# EAGLE schematic ProPinEZMachBAutoRouteV2c (EAGLE 7.1.0)
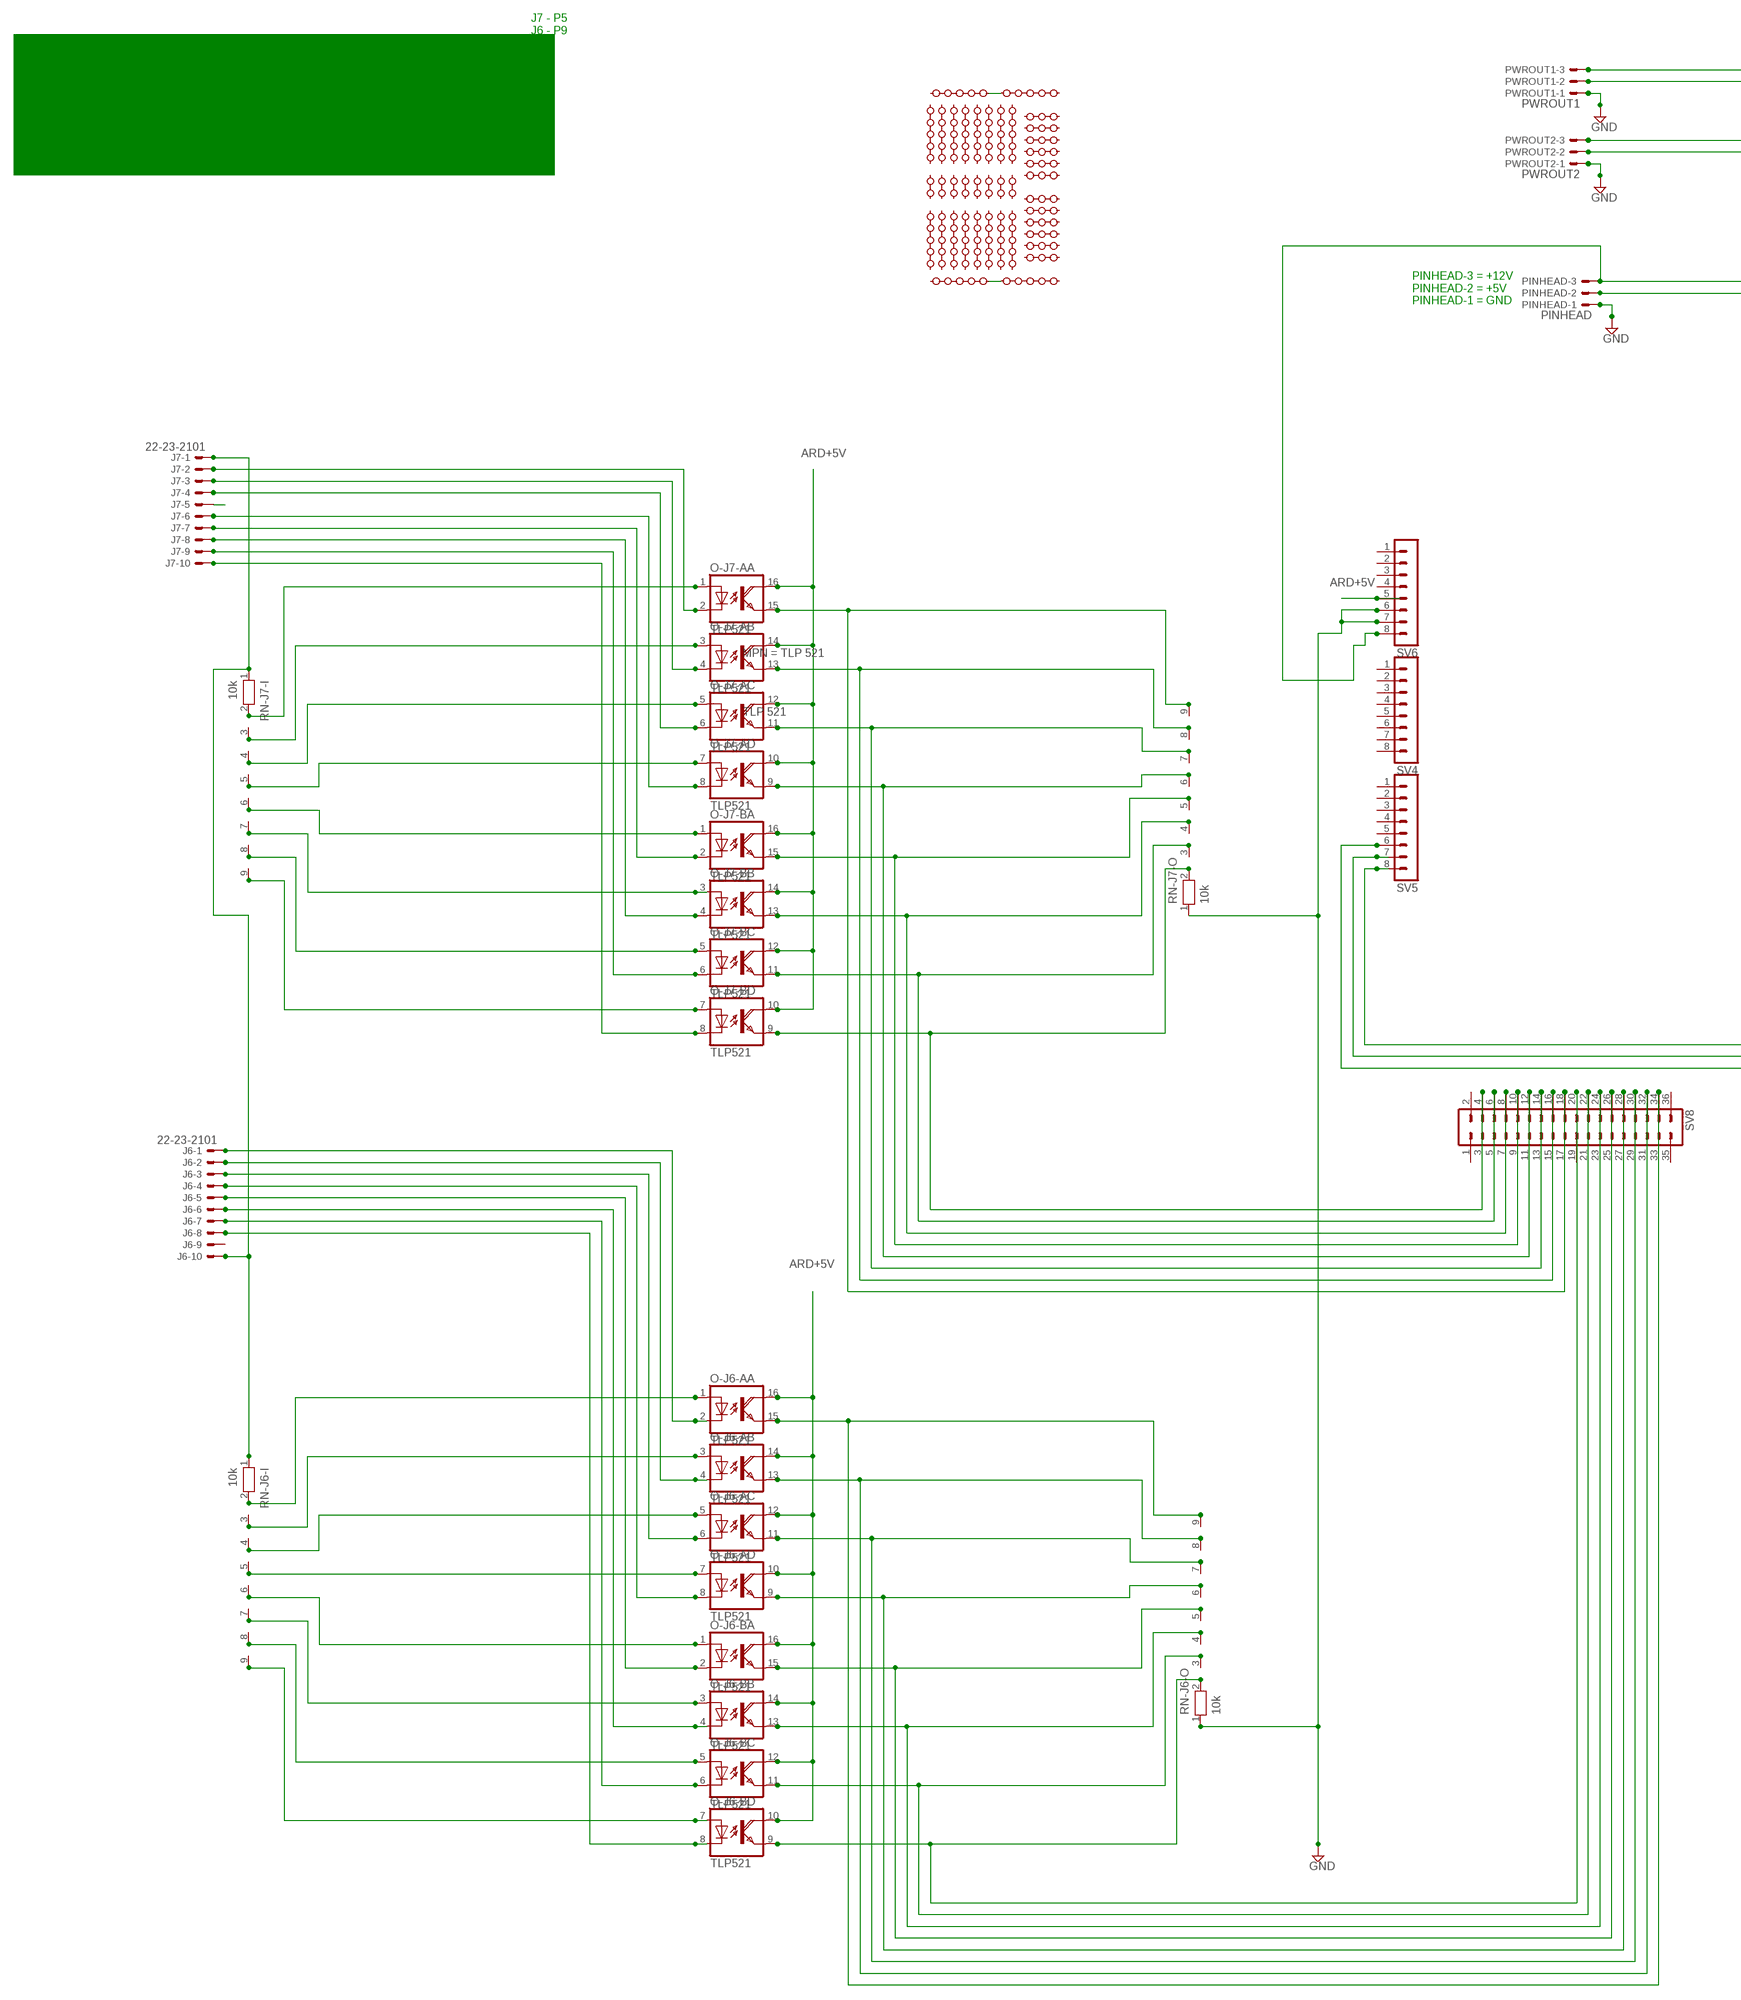
[diagram p0: schematic, sheet 1, part 1 of 2]
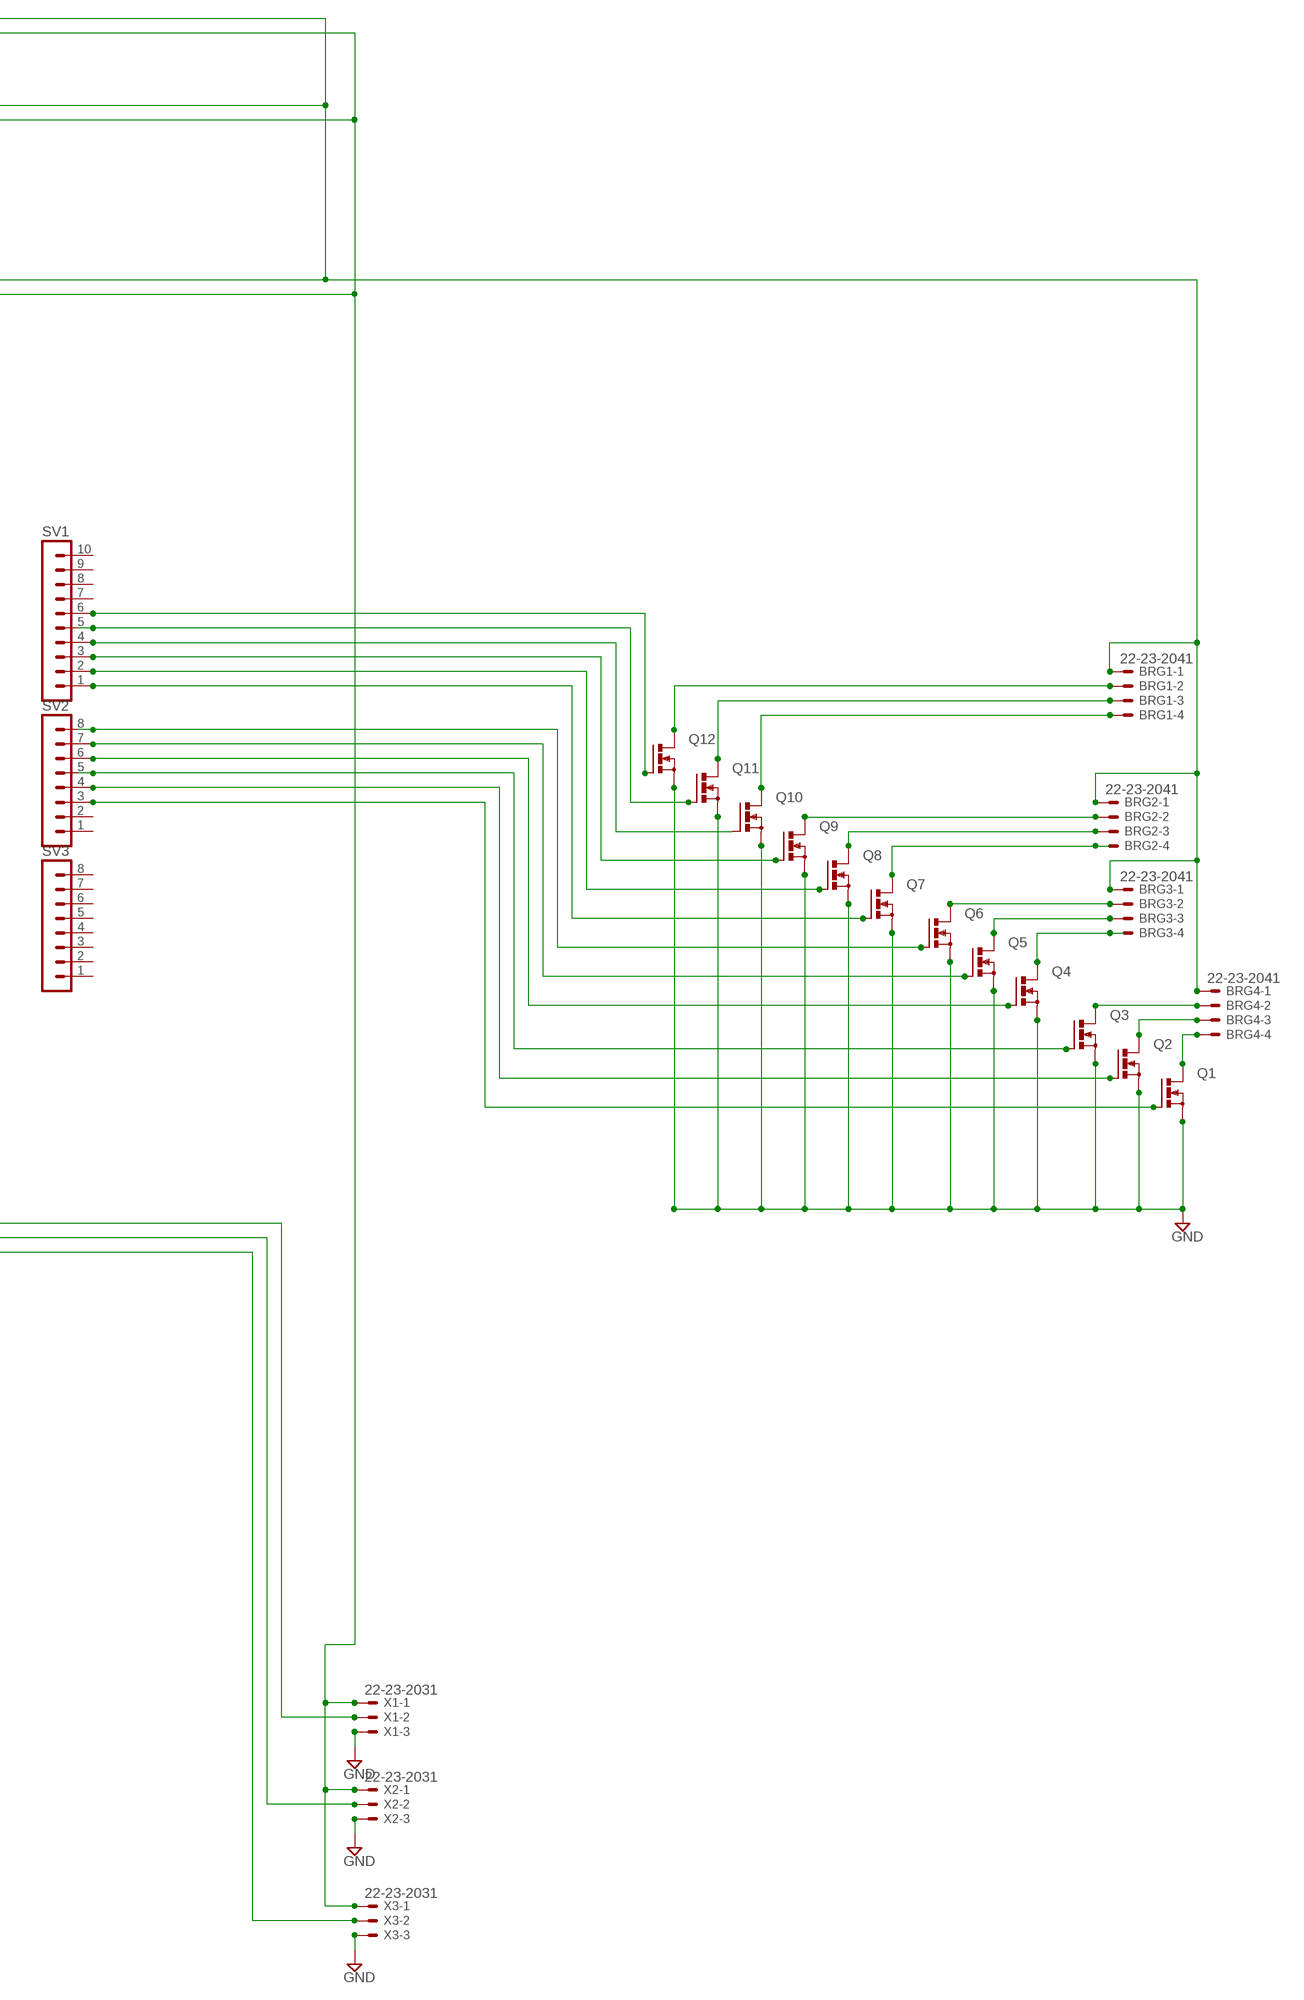
[diagram p1: schematic, sheet 1, part 2 of 2]

## Parts
BRG1  22-23-2041  [22-23-2041]
BRG2  22-23-2041  [22-23-2041]
BRG3  22-23-2041  [22-23-2041]
BRG4  22-23-2041  [22-23-2041]
J6  22-23-2101  [22-23-2101]
J7  22-23-2101  [22-23-2101]
O-J6-A  TLP521  TIL199  [DIL16]
O-J6-B  TLP521  TIL199  [DIL16]
O-J7-A  TLP521  TIL199  [DIL16]
O-J7-B  TLP521  TIL199  [DIL16]
P1  PADSTRIP5-HA  [PADSTRIP-5H]
P2  PADSTRIP5-HA  [PADSTRIP-5H]
P3  PADSTRIP5-HA  [PADSTRIP-5H]
P4  PADSTRIP5-HA  [PADSTRIP-5H]
P5  PADSTRIP5-HA  [PADSTRIP-5H]
P6  PADSTRIP5-HA  [PADSTRIP-5H]
P7  PADSTRIP5-HA  [PADSTRIP-5H]
P8  PADSTRIP5-HA  [PADSTRIP-5H]
P9  PADSTRIP5-HA  [PADSTRIP-5H]
P10  PADSTRIP5-HA  [PADSTRIP-5H]
P11  PADSTRIP5-HA  [PADSTRIP-5H]
P12  PADSTRIP5-HA  [PADSTRIP-5H]
P13  PADSTRIP5-HA  [PADSTRIP-5H]
P14  PADSTRIP5-HA  [PADSTRIP-5H]
P15  PADSTRIP5-HA  [PADSTRIP-5H]
P16  PADSTRIP5-HA  [PADSTRIP-5H]
P17  PADSTRIP5-HB  [PADSTRIP-5HC]
P18  PADSTRIP5-HB  [PADSTRIP-5HC]
P19  PADSTRIP5-HB  [PADSTRIP-5HC]
P20  PADSTRIP5-HB  [PADSTRIP-5HC]
PINHEAD  PINHEAD  22-23-2031  [22-23-2031]
PR1  PADSTRIP3-H  [PADSTRIP-3H]
PR2  PADSTRIP3-H  [PADSTRIP-3H]
PR3  PADSTRIP3-H  [PADSTRIP-3H]
PR4  PADSTRIP3-H  [PADSTRIP-3H]
PR5  PADSTRIP3-H  [PADSTRIP-3H]
PR6  PADSTRIP3-H  [PADSTRIP-3H]
PR7  PADSTRIP3-H  [PADSTRIP-3H]
PR8  PADSTRIP3-H  [PADSTRIP-3H]
PR9  PADSTRIP3-H  [PADSTRIP-3H]
PR10  PADSTRIP3-H  [PADSTRIP-3H]
PR13  PADSTRIP2-H  [PADSTRIP-2H]
PR14  PADSTRIP2-H  [PADSTRIP-2H]
PR15  PADSTRIP2-H  [PADSTRIP-2H]
PR16  PADSTRIP2-H  [PADSTRIP-2H]
PR17  PADSTRIP2-H  [PADSTRIP-2H]
PR18  PADSTRIP2-H  [PADSTRIP-2H]
PR19  PADSTRIP2-H  [PADSTRIP-2H]
PR20  PADSTRIP2-H  [PADSTRIP-2H]
PR23  PADSTRIP3-H  [PADSTRIP-3H]
PR24  PADSTRIP3-H  [PADSTRIP-3H]
PWROUT1  PWROUT1  22-23-2031  [22-23-2031]
PWROUT2  PWROUT2  22-23-2031  [22-23-2031]
Q1  PMOSFET_NTO220BV  [TO220BV]
Q2  PMOSFET_NTO220BV  [TO220BV]
Q3  PMOSFET_NTO220BV  [TO220BV]
Q4  PMOSFET_NTO220BV  [TO220BV]
Q5  PMOSFET_NTO220BV  [TO220BV]
Q6  PMOSFET_NTO220BV  [TO220BV]
Q7  PMOSFET_NTO220BV  [TO220BV]
Q8  PMOSFET_NTO220BV  [TO220BV]
Q9  PMOSFET_NTO220BV  [TO220BV]
Q10  PMOSFET_NTO220BV  [TO220BV]
Q11  PMOSFET_NTO220BV  [TO220BV]
Q12  PMOSFET_NTO220BV  [TO220BV]
RN-J6-I  10k  RN08  [RN-9]
RN-J6-O  10k  RN08  [RN-9]
RN-J7-I  10k  RN08  [RN-9]
RN-J7-O  10k  RN08  [RN-9]
SV1  MA10-1  [MA10-1]
SV2  MA08-1  [MA08-1]
SV3  MA08-1  [MA08-1]
SV4  MA08-1  [MA08-1]
SV5  MA08-1  [MA08-1]
SV6  MA08-1  [MA08-1]
SV8  MA18-2  [MA18-2]
X1  22-23-2031  [22-23-2031]
X2  22-23-2031  [22-23-2031]
X3  22-23-2031  [22-23-2031]

## Nets
ARD+5V [Power]: O-J6-A.10(D:COL) O-J6-A.12(C:COL) O-J6-A.14(B:COL) O-J6-A.16(A:COL) O-J6-B.10(D:COL) O-J6-B.12(C:COL) O-J6-B.14(B:COL) O-J6-B.16(A:COL) O-J7-A.10(D:COL) O-J7-A.12(C:COL) O-J7-A.14(B:COL) O-J7-A.16(A:COL) O-J7-B.10(D:COL) O-J7-B.12(C:COL) O-J7-B.14(B:COL) O-J7-B.16(A:COL) SV6.5
GND: PINHEAD.1 PWROUT1.1 PWROUT2.1 Q1.S Q2.S Q3.S Q4.S Q5.S Q6.S Q7.S Q8.S Q9.S Q10.S Q11.S Q12.S RN-J6-O.1 RN-J7-O.1 SV6.6 SV6.7 X1.3 X2.3 X3.3
N$1: P17.5 P18.5
N$2: J7.5
N$3: O-J7-A.3(B:A) RN-J7-I.3
N$4: O-J7-A.5(C:A) RN-J7-I.4
N$5: O-J7-A.7(D:A) RN-J7-I.5
N$6: O-J7-B.1(A:A) RN-J7-I.6
N$7: O-J7-B.3(B:A) RN-J7-I.7
N$8: O-J7-B.5(C:A) RN-J7-I.8
N$9: O-J7-A.1(A:A) RN-J7-I.2
N$10: J7.2 O-J7-A.2(A:C)
N$11: J7.3 O-J7-A.4(B:C)
N$12: J7.4 O-J7-A.6(C:C)
N$13: J7.6 O-J7-A.8(D:C)
N$14: J7.7 O-J7-B.2(A:C)
N$15: J7.8 O-J7-B.4(B:C)
N$16: J7.9 O-J7-B.6(C:C)
N$17: J7.10 O-J7-B.8(D:C)
N$18 [GND]: J6.10 J7.1 RN-J6-I.1 RN-J7-I.1
N$19: J6.1 O-J6-A.2(A:C)
N$20: J6.2 O-J6-A.4(B:C)
N$21: J6.3 O-J6-A.6(C:C)
N$22: J6.4 O-J6-A.8(D:C)
N$23: J6.5 O-J6-B.2(A:C)
N$24: O-J7-B.7(D:A) RN-J7-I.9
N$25: J6.6 O-J6-B.4(B:C)
N$26: J6.7 O-J6-B.6(C:C)
N$27: J6.8 O-J6-B.8(D:C)
N$28: O-J6-A.1(A:A) RN-J6-I.2
N$29: O-J6-A.3(B:A) RN-J6-I.3
N$30: O-J6-A.5(C:A) RN-J6-I.4
N$31: O-J6-A.7(D:A) RN-J6-I.5
N$32: O-J6-B.1(A:A) RN-J6-I.6
N$33: O-J6-B.3(B:A) RN-J6-I.7
N$34: O-J6-B.5(C:A) RN-J6-I.8
N$35: O-J6-B.7(D:A) RN-J6-I.9
N$36: O-J7-A.9(D:EMI) RN-J7-O.6 SV8.12
N$37: O-J7-A.11(C:EMI) RN-J7-O.7 SV8.14
N$38: O-J7-A.13(B:EMI) RN-J7-O.8 SV8.16
N$39: O-J7-A.15(A:EMI) RN-J7-O.9 SV8.18
N$40: O-J7-B.9(D:EMI) RN-J7-O.2 SV8.4
N$41: O-J7-B.11(C:EMI) RN-J7-O.3 SV8.6
N$42: O-J7-B.13(B:EMI) RN-J7-O.4 SV8.8
N$43: O-J7-B.15(A:EMI) RN-J7-O.5 SV8.10
N$44: P19.5 P20.5
N$45: Q10.G SV1.4
N$46 [Power]: SV5.8 X1.2
N$47 [Power]: PINHEAD.2 PWROUT1.2 PWROUT2.2 X1.1 X2.1 X3.1
N$48 [Power]: SV5.7 X2.2
N$49 [Power]: SV5.6 X3.2
N$50 [Power]: BRG4.2 Q3.D
N$51 [Power]: BRG3.4 Q4.D
N$52: BRG1.2 Q12.D
N$55: Q1.G SV2.3
N$57 [Power]: BRG3.3 Q5.D
N$58 [Power]: BRG3.2 Q6.D
N$59: O-J6-A.15(A:EMI) RN-J6-O.9 SV8.34
N$60: O-J6-A.13(B:EMI) RN-J6-O.8 SV8.32
N$61: O-J6-A.11(C:EMI) RN-J6-O.7 SV8.30
N$62: O-J6-A.9(D:EMI) RN-J6-O.6 SV8.28
N$63: O-J6-B.15(A:EMI) RN-J6-O.5 SV8.26
N$64: O-J6-B.13(B:EMI) RN-J6-O.4 SV8.24
N$65: O-J6-B.11(C:EMI) RN-J6-O.3 SV8.22
N$66: O-J6-B.9(D:EMI) RN-J6-O.2 SV8.20
N$69: Q2.G SV2.4
N$70: Q3.G SV2.5
N$71: Q4.G SV2.6
N$72: Q5.G SV2.7
N$73 [Power]: BRG2.4 Q7.D
N$74 [Power]: BRG2.3 Q8.D
N$75 [Power]: BRG2.2 Q9.D
N$76 [Power]: BRG1.1 BRG2.1 BRG3.1 BRG4.1 PINHEAD.3 PWROUT1.3 PWROUT2.3 SV6.8
N$77: Q6.G SV2.8
N$78: Q7.G SV1.1
N$79: Q8.G SV1.2
N$80 [Power]: BRG4.4 Q1.D
N$81: Q9.G SV1.3
N$82 [Power]: BRG4.3 Q2.D
N$84: Q11.G SV1.5
N$85 [Power]: BRG1.4 Q10.D
N$86 [Power]: BRG1.3 Q11.D
N$88: Q12.G SV1.6
Unconnected: J6.9 P1.1 P1.5 P2.1 P2.5 P3.1 P3.5 P4.1 P4.5 P5.1 P5.5 P6.1 P6.5 P7.1 P7.5 P8.1 P8.5 P9.1 P9.5 P10.1 P10.5 P11.1 P11.5 P12.1 P12.5 P13.1 P13.5 P14.1 P14.5 P15.1 P15.5 P16.1 P16.5 P17.1 P18.1 P19.1 P20.1 PR1.1(LFT) PR1.3(RIT) PR2.1(LFT) PR2.3(RIT) PR3.1(LFT) PR3.3(RIT) PR4.1(LFT) PR4.3(RIT) PR5.1(LFT) PR5.3(RIT) PR6.1(LFT) PR6.3(RIT) PR7.1(LFT) PR7.3(RIT) PR8.1(LFT) PR8.3(RIT) PR9.1(LFT) PR9.3(RIT) PR10.1(LFT) PR10.3(RIT) PR13.1(LFT) PR13.2(RIT) PR14.1(LFT) PR14.2(RIT) PR15.1(LFT) PR15.2(RIT) PR16.1(LFT) PR16.2(RIT) PR17.1(LFT) PR17.2(RIT) PR18.1(LFT) PR18.2(RIT) PR19.1(LFT) PR19.2(RIT) PR20.1(LFT) PR20.2(RIT) PR23.1(LFT) PR23.3(RIT) PR24.1(LFT) PR24.3(RIT) SV1.7 SV1.8 SV1.9 SV1.10 SV2.1 SV2.2 SV3.1 SV3.2 SV3.3 SV3.4 SV3.5 SV3.6 SV3.7 SV3.8 SV4.1 SV4.2 SV4.3 SV4.4 SV4.5 SV4.6 SV4.7 SV4.8 SV5.1 SV5.2 SV5.3 SV5.4 SV5.5 SV6.1 SV6.2 SV6.3 SV6.4 SV8.1 SV8.2 SV8.3 SV8.5 SV8.7 SV8.9 SV8.11 SV8.13 SV8.15 SV8.17 SV8.19 SV8.21 SV8.23 SV8.25 SV8.27 SV8.29 SV8.31 SV8.33 SV8.35 SV8.36

## Notes on the sheet
- J7 - P5
  J6 - P9
- J7 - P5 | TEST | TEST
- J7 - P5
  J6 - P9
- J7 - P5
  J6 - P9
- J7 - P5
  J6 - P9
- J7 - P5
  J6 - P9
- J7 - P5
  J6 - P9
- J7 - P5
  J6 - P9
- J7 - P5
  J6 - P9
- J7 - P5
  J6 - P9
- J7 - P5
  J6 - P9
- PINHEAD-3 = +12V
  PINHEAD-2 = +5V
  PINHEAD-1 = GND

## Library data of the parts
BRG1-BRG4 = con-molex:22-23-2041: .100" (2.54mm) Center Header - 4 Pin; MF: MOLEX; MPN: 22-23-2041; OC_FARNELL: 1462920; OC_NEWARK: 38C0355
J6 J7 = con-molex:22-23-2101: .100" (2.54mm) Center Header - 10 Pin; MF: MOLEX; MPN: 22-23-2101; OC_FARNELL: 1756828; OC_NEWARK: 94C0765
O-J6-A O-J6-B O-J7-B = optocoupler:TIL199: TEXAS INSTRUMENTS OPTO COUPLER; MPN: TIL 199; OC_FARNELL: 1683370; OC_NEWARK: 05R6483
O-J7-A = optocoupler:TIL199: TEXAS INSTRUMENTS OPTO COUPLER; MPN: TLP 521; OC_FARNELL: 1683370; OC_NEWARK: 05R6483
P1-P16 = proto:PADSTRIP5-H: Strip of 5 connected pads; BOM: no; VALSTAT: label
P17-P20 = proto:PADSTRIP5-H: Strip of 5 connected pads
PINHEAD PWROUT1 PWROUT2 X1-X3 = con-molex:22-23-2031: .100" (2.54mm) Center Header - 3 Pin; MF: MOLEX; MPN: 22-23-2031; OC_FARNELL: 1462950; OC_NEWARK: 30C0862
PR1-PR10 PR23 PR24 = proto:PADSTRIP3-H: Strip of 3 connected pads; BOM: no; VALSTAT: label
PR13-PR20 = proto:PADSTRIP2-H: Strip of 2 connected pads; BOM: no; VALSTAT: label
Q1-Q12 = transistor-power:PMOSFET_N: Power MOSFET N-Channel
RN-J6-I RN-J6-O RN-J7-I RN-J7-O = resistor-net:RN08: RESISTOR NETWORK; OC_FARNELL: unknown; OC_NEWARK: unknown
SV1 = con-lstb:MA10-1: PIN HEADER; OC_FARNELL: unknown; OC_NEWARK: unknown
SV2-SV6 = con-lstb:MA08-1: PIN HEADER; OC_FARNELL: unknown; OC_NEWARK: unknown
SV8 = con-lstb:MA18-2: PIN HEADER; OC_FARNELL: unknown; OC_NEWARK: unknown

## Net classes
0 default: width 0.406 mm
1 Power: width 0.61 mm
2 GND: width 0.61 mm